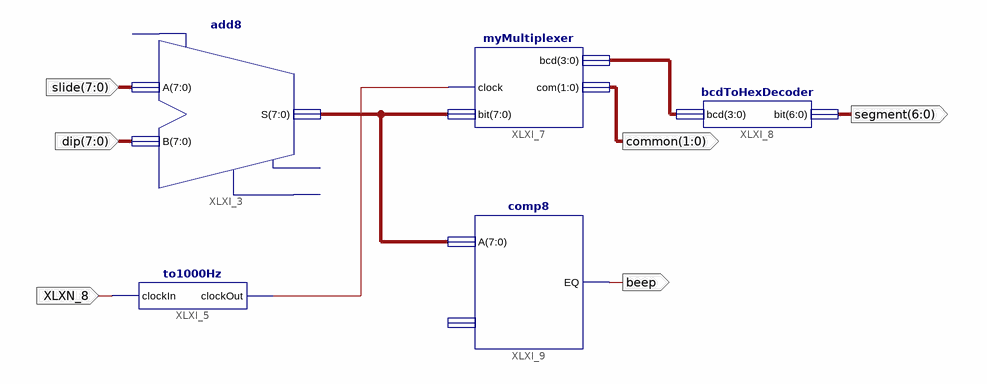
[diagram p0: schematic sheet 1]
// Xilinx ISE schematic lab8.sch (spartan6) as structural Verilog: 5 symbols, 6 ports
module lab8 (
  input  [7:0] slide,
  input  [7:0] dip,
  input  XLXN_8,
  output [1:0] common,
  output [6:0] segment,
  output beep
);

  wire XLXN_11;
  wire [3:0] XLXN_13;
  wire [7:0] XLXN_10;

  add8 XLXI_3 (.A(slide), .B(dip), .S(XLXN_10));  // open: CI, CO, OFL
  to1000Hz XLXI_5 (.clockIn(XLXN_8), .clockOut(XLXN_11));
  myMultiplexer XLXI_7 (.\bit (XLXN_10), .clock(XLXN_11), .com(common), .bcd(XLXN_13));
  bcdToHexDecoder XLXI_8 (.bcd(XLXN_13), .\bit (segment));
  comp8 XLXI_9 (.A(XLXN_10), .EQ(beep));  // open: B
endmodule
